# Altium project 12S ESC.PrjPcb
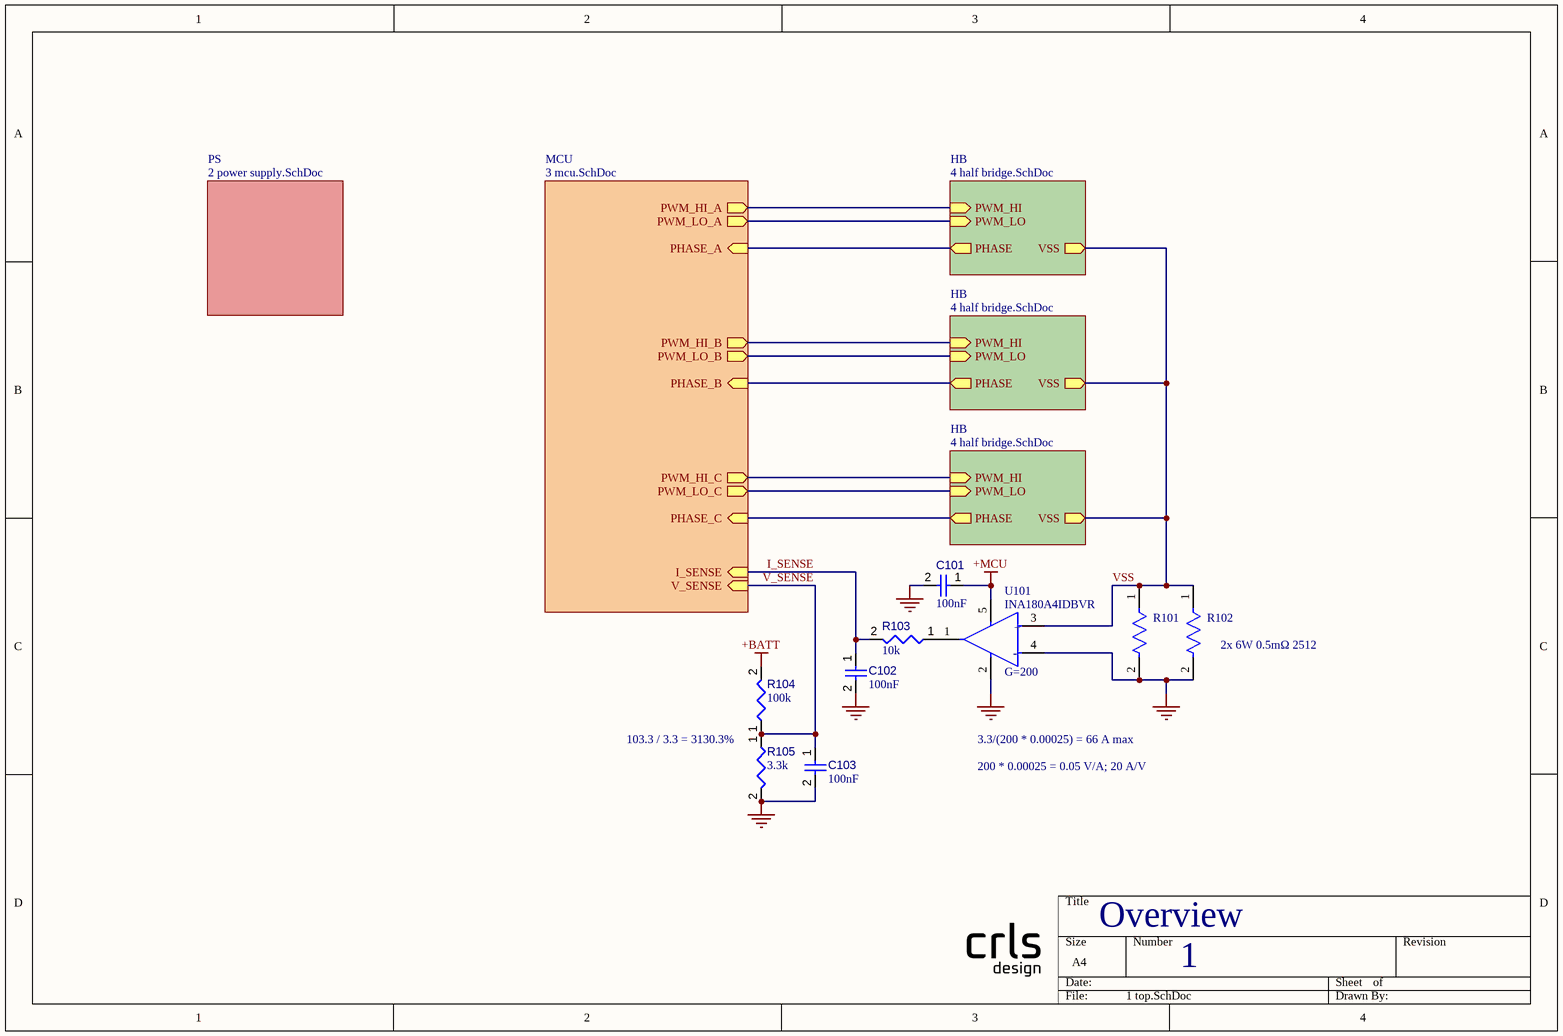
[diagram p0: 1 top.SchDoc]
4 sheets, 91 parts. Net scope: hierarchical (ports join the sheet entries above them; power ports are global).
Board files: main.PcbDoc, panel 1x1.PcbDoc, panel 2x1.PcbDoc
Sheets:
  1 top.SchDoc
    PS = 2 power supply.SchDoc
    MCU = 3 mcu.SchDoc
    HB = 4 half bridge.SchDoc
    HB = 4 half bridge.SchDoc
    HB = 4 half bridge.SchDoc

## Sheet 1 top.SchDoc
size A4; SheetNumber: 1; SheetTotal: 4

### Parts
C101  value 100nF  [CAPC0402(1005)60_L]  (hidden comment: Capacitor 100nF +/-20% 25V 0402)
C102  value 100nF  [CAPC0402(1005)60_L]  (hidden comment: Capacitor 100nF +/-20% 25V 0402)
C103  value 100nF  [CAPC0402(1005)60_L]  (hidden comment: Capacitor 100nF +/-20% 25V 0402)
R101  PSL2NTEBL500F  [FP-PSL2NTEBL500F-MFG]  (value not drawn)
R102  PSL2NTEBL500F  [FP-PSL2NTEBL500F-MFG]  (value not drawn)
R103  value 10k  [RESC0402(1005)_L]  (hidden comment: Resistor 10K  +/-1 % 0402 63 mW)
R104  value 100k  [RESC0402(1005)_L]  (hidden comment: Resistor 100K +/-1 % 0402 63 mW)
R105  value 3.3k  [RESC0402(1005)_L]  (hidden comment: Resistor 3K3 +/-1 % 0402 63 mW)
U101  INA180A4IDBVR  [FP-DBV0005A-MFG]

### Sub-sheets
HB = 4 half bridge.SchDoc: PWM_HI (in), PWM_LO (in), PHASE (out), VSS (out)
HB = 4 half bridge.SchDoc: PWM_HI (in), PWM_LO (in), PHASE (out), VSS (out)
HB = 4 half bridge.SchDoc: PWM_HI (in), PWM_LO (in), PHASE (out), VSS (out)
MCU = 3 mcu.SchDoc: PHASE_A (in), PHASE_B (in), PHASE_C (in), PWM_HI_A (out), PWM_LO_A (out), PWM_HI_B (out), PWM_LO_B (out), PWM_HI_C (out), PWM_LO_C (out), V_SENSE (in), I_SENSE (in)
PS = 2 power supply.SchDoc: no entries

### Nets
+BATT: R104.2
+MCU: C101.1 U101.5(VS)
GND: C101.2 C102.2 C103.2 R101.2 R102.2 R105.2 U101.2(GND) U101.4(IN-)
I_SENSE: C102.1 R103.2 ; sheet MCU/I_SENSE
PHASE_A: sheet MCU/PHASE_A, sheet HB/PHASE
PHASE_B: sheet MCU/PHASE_B, sheet HB/PHASE
PHASE_C: sheet MCU/PHASE_C, sheet HB/PHASE
PWM_H_A: sheet MCU/PWM_HI_A, sheet HB/PWM_HI
PWM_H_B: sheet MCU/PWM_HI_B, sheet HB/PWM_HI
PWM_H_C: sheet MCU/PWM_HI_C, sheet HB/PWM_HI
PWM_L_A: sheet MCU/PWM_LO_A, sheet HB/PWM_LO
PWM_L_B: sheet MCU/PWM_LO_B, sheet HB/PWM_LO
PWM_L_C: sheet MCU/PWM_LO_C, sheet HB/PWM_LO
V_SENSE: C103.1 R104.1 R105.1 ; sheet MCU/V_SENSE
VSS: R101.1 R102.1 U101.3(IN+) ; sheet HB/VSS, sheet HB/VSS, sheet HB/VSS
NetR103_1: R103.1 U101.1(OUT)

### Notes on the sheet
- (near R102) 2x 6W 0.5mΩ 2512
- (near U101) G=200
- (near R105) 103.3 / 3.3 = 3130.3%
- 3.3/(200 * 0.00025) = 66 A max
- 200 * 0.00025 = 0.05 V/A; 20 A/V
- Overview
- (in symbol CMP-04895-000244-1) +; -

### Library data of the parts
C101-C103 = CMP-001-00065-4: Chip Capacitor, 100nF +/-20%, 25V, 0402, Thickness 0.6 mm; Tolerance: 10%; Max Operating Temperature: 85°C; Min Operating Temperature: -55°C; Pins: 2; Voltage Rating: 25V; Mounting Technology: SMT; Case/Package: 0402
R101 R102 = CMP-04015-070281-1: RES 500 UOHM 1% 8W NONSTANDARD; RoHS Compliant: Yes
R103 = CMP-009-00149-3: Chip Resistor, 10 kOhms, +/-1 %, 63 mW, -55 to 125 degC, 0402; Power: 63mW; Tolerance: 1%; Min Operating Temperature: -55°C; Case/Package: 0402; Max Operating Temperature: 155°C; Pins: 2
R104 = CMP-009-00168-3: Chip Resistor, 100 kOhms, +/-1 %, 63 mW, -55 to 155 degC, 0402; Tolerance: 1%; Power: 63mW; Max Operating Temperature: 155°C; Min Operating Temperature: -55°C; Pins: 2; Case/Package: 0402
R105 = CMP-009-00145-3: Chip Resistor, 3.3 kOhms, +/-1 %, 63 mW, -55 to 155 degC, 0402; Tolerance: 1%; Power: 63mW; Case/Package: 0402; Min Operating Temperature: -55°C; Max Operating Temperature: 155°C; Pins: 2
U101 = CMP-04895-000244-1: IC CURR SENSE 1 CIRCUIT SOT23-5; Operating Supply Current: 260uA; Number of Circuits: 1; Input Bias Current: 100nA; -3db Bandwidth: 350kHz; Input Offset Voltage (Vos): 100uV; Slew Rate: 2V/µs; Case/Package: SOT-23-5; Min Operating Temperature: -40°C; Packaging: Tape and Reel; Max Operating Temperature: 125°C; Mount: Surface Mount; RoHS Compliant: Yes

## Sheet 2 power supply.SchDoc
size A4; SheetNumber: 2; SheetTotal: 4
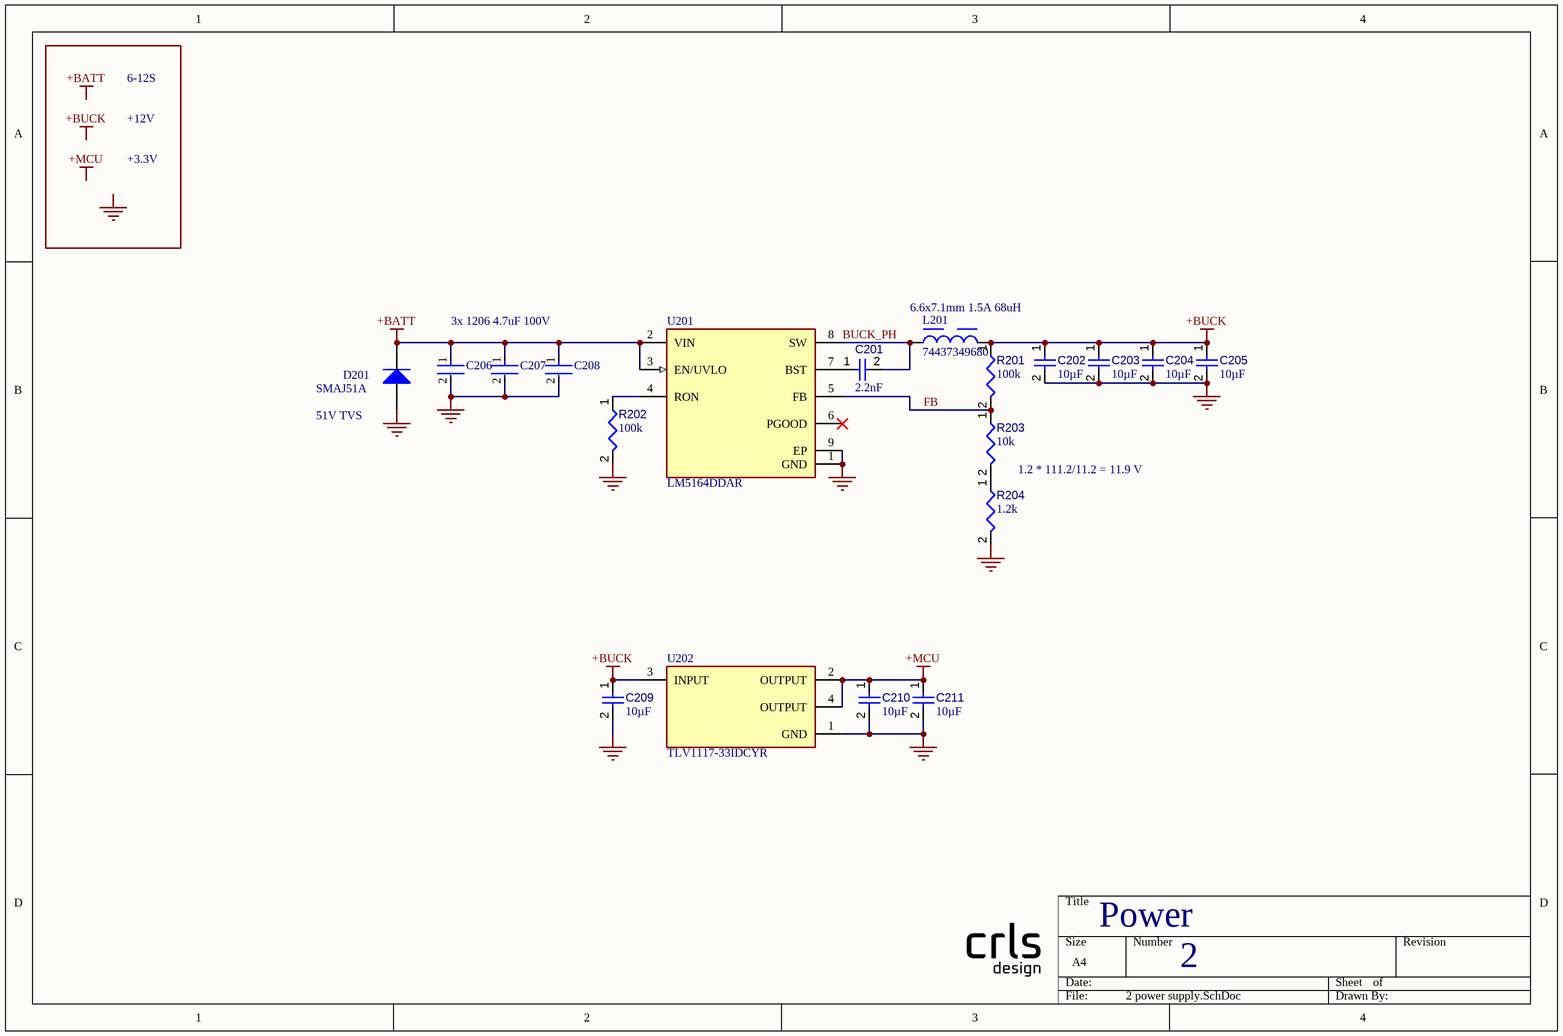
[diagram p1: 2 power supply.SchDoc]

### Parts
C201  value 2.2nF  [CAPC0402(1005)33_L]  (hidden comment: Capacitor 2.2nF +/-20% 50V 0402)
C202  value 10µF  [CAPC0603(1608)100_L]  (hidden comment: Capacitor 10µF +/-20% 10V 0603)
C203  value 10µF  [CAPC0603(1608)100_L]  (hidden comment: Capacitor 10µF +/-20% 10V 0603)
C204  value 10µF  [CAPC0603(1608)100_L]  (hidden comment: Capacitor 10µF +/-20% 10V 0603)
C205  value 10µF  [CAPC0603(1608)100_L]  (hidden comment: Capacitor 10µF +/-20% 10V 0603)
C206  12061Z475KAT2A  [FP-1206-L_3_2_0_2-W_1_6_0-MFG]  (value not drawn)
C207  12061Z475KAT2A  [FP-1206-L_3_2_0_2-W_1_6_0-MFG]  (value not drawn)
C208  12061Z475KAT2A  [FP-1206-L_3_2_0_2-W_1_6_0-MFG]  (value not drawn)
C209  value 10µF  [CAPC0603(1608)100_L]  (hidden comment: Capacitor 10µF +/-20% 10V 0603)
C210  value 10µF  [CAPC0603(1608)100_L]  (hidden comment: Capacitor 10µF +/-20% 10V 0603)
C211  value 10µF  [CAPC0603(1608)100_L]  (hidden comment: Capacitor 10µF +/-20% 10V 0603)
D201  SMAJ51A  [VISH-DO-214AC-2_N]
L201  74437349680  [WE-LHMI_7050]
R201  value 100k  [RESC0402(1005)_L]  (hidden comment: Resistor 100K +/-1 % 0402 63 mW)
R202  value 100k  [RESC0402(1005)_L]  (hidden comment: Resistor 100K +/-1 % 0402 63 mW)
R203  value 10k  [RESC0402(1005)_L]  (hidden comment: Resistor 10K  +/-1 % 0402 63 mW)
R204  value 1.2k  [RESC0402(1005)_L]  (hidden comment: Resistor 1K2 +/-1 % 0402 63 mW)
U201  LM5164DDAR  [FP-DDA0008E-MFG]
U202  TLV1117-33IDCYR  [FP-DCY0004A-MFG]

### Nets
+BATT: C206.1 C207.1 C208.1 D201.1(K) U201.2(VIN) U201.3(EN/UVLO)
+BUCK: C202.1 C203.1 C204.1 C205.1 C209.1 L201.2 R201.1 U202.3(INPUT)
+MCU: C210.1 C211.1 U202.2(OUTPUT) U202.4(OUTPUT)
GND: C202.2 C203.2 C204.2 C205.2 C206.2 C207.2 C208.2 C209.2 C210.2 C211.2 D201.2(A) R202.2 R204.2 U201.1(GND) U201.9(EP) U202.1(GND)
BUCK_PH: C201.2 L201.1 U201.8(SW)
FB: R201.2 R203.1 U201.5(FB)
NetC201_1: C201.1 U201.7(BST)
NetR202_1: R202.1 U201.4(RON)
NetR203_2: R203.2 R204.1

Not connected (* = marked no-connect by the designer): U201 6(PGOOD)*

### Notes on the sheet
- 6-12S
- +12V
- +3.3V
- 6.6x7.1mm 1.5A 68uH
- 3x 1206 4.7uF 100V
- (near D201) 51V TVS
- 1.2 * 111.2/11.2 = 11.9 V
- Power
- Labels drawn without touching a wire or pin: +BATT, +BUCK, +MCU, GND

### Library data of the parts
C201 = CMP-001-00066-3: Chip Capacitor, 1nF +/-20%, 50V, 0402, Thickness 0.33 mm; Tolerance: 10%; Case/Package: 0402; Pins: 2; Min Operating Temperature: -55°C; Max Operating Temperature: 85°C; Voltage Rating: 50V; Mounting Technology: SMT
C202-C205 C209-C211 = CMP-001-00075-4: Chip Capacitor, 10µF +/-20%, 10V, 0603, Thickness 1 mm; Tolerance: 10%; Voltage Rating: 10V; Max Operating Temperature: 85°C; Pins: 2; Case/Package: 0603; Mounting Technology: SMT; Min Operating Temperature: -55°C
C206-C208 = CMP-2000-05019-2: CAP CER 4.7UF 100V X7S 1206; Tolerance: 10%; Thickness: 0.075inch; Max Operating Temperature: 125°C; Termination: SMD/SMT; Dielectric: X7S; Case Code (Metric): 3216; Case/Package: 1206; Height: 0.5mm; Mount: Surface Mount; Voltage Rating (DC): 100V; Min Operating Temperature: -55°C; Package Quantity: 1; Length: 3.2mm; Voltage Rating: 100V; Lead Free: Lead Free; RoHS Compliant: Yes; Packaging: Tape and Reel; Weight: 0.000571oz; Capacitance: 4.7uF; REACH SVHC: No SVHC; Case Code (Imperial): 1206; Width: 0.063inch; Depth: 1.6mm
D201 = CMP-0544-00031-2: Transient Voltage Suppressor, 6.40 to 231 V, 51 V Stand-off Voltage, Uni-Directional, -55 to 155 degC, 2-pin DO-214AC, Pb-Free, Tape and Reel; Manufacturer: Vishay Semiconductor; PartNumber: SMAJ51A-E3/5A; IFSM: 40 A; ID (uA): 1; VBR Uni-Directional (V): 6.4 to 231; PPPM (W): 400, 300; VWM (V): 51; ComponentLink3Description: Package Specification; PackageDescription: 2-Pin DO-214AC (SMA), Body 4.245 x 2.665 mm; ComponentLink1Description: Manufacturer URL; ComponentLink2Description: Datasheet; ComponentLink3URL: http://www.vishay.com/docs/88390/smaj50a.pdf; DatasheetVersion: 12/8/2013; ComponentLink2URL: http://www.vishay.com/docs/88390/smaj50a.pdf; PackageReference: DO-214AC-2; RoHS: TRUE; Operating Junction and Storage Temperature Range: -55 to 150 degC; ComponentLink1URL: http://www.vishay.com/; Packing: Tape and Reel; Mounting Technology: Surface Mount
L201 = CMP-1353-00069-6: NexarPartId: 65255814; Inductance Tolerance: 20%; Saturation Current: 1.45A; Inductance: 68µH; DC Resistance (DCR): 386mΩ; Ambient Temperature Range High: 85°C; Ambient Temperature Range Low: -40°C; RoHS: Compliant; Length: 7.3mm; Min Operating Temperature: -40°C; Max Operating Temperature: 125°C; Height: 4.8mm; Width: 6.6mm
R201 R202 = CMP-009-00168-3: as R104 on sheet 1 top; Max Operating Temperature: 155°C; Min Operating Temperature: -55°C; Pins: 2; Case/Package: 0402
R203 = CMP-009-00149-3: as R103 on sheet 1 top; Min Operating Temperature: -55°C; Case/Package: 0402; Max Operating Temperature: 155°C; Pins: 2
R204 = CMP-009-00157-3: Chip Resistor, 1.2 kOhms, +/-1 %, 63 mW, -55 to 155 degC, 0402; Tolerance: 1%; Power: 63mW; Case/Package: 0402; Pins: 2; Min Operating Temperature: -55°C; Max Operating Temperature: 155°C
U201 = CMP-04918-000011-1: POWER MANAGEMENT; Manufacturer: Texas Instruments; Standoff Height: 0mm; Max Supply Voltage: 100V; Output Voltage: 1.2-90V; Max Duty Cycle: 99%; Nominal Supply Current: 600uA; Output Current: 1A; Min Supply Voltage: 6V; Output Type: AdjustableProgrammable; Max Junction Temp: +150°C; Number Of Outputs: 1; Switching Frequency: 1000kHz; Switching Topology: Buck; Temperature: -40°C to +150°C; Device Class L1: Integrated Circuits (ICs); Automotive: No; Lead Free: Yes; Package: DDA0008E; Device Class L3: Voltage Regulators - Switching; Manufacturer Part Number: LM5164DDAR; Device Class L2: Power Management ICs; RoHS: TRUE; Mouser Description: 6-V to 100-V input, 1-A synchronous buck DC-DC converter with ultra-low IQ 8-SO PowerPAD -40 to 150; Temperature Range Low: -40°C; ComponentLink2Description: Datasheet; Temperature Range High: +150°C; ComponentLink2URL: http://www.ti.com/lit/ds/symlink/lm5164.pdf; Digikey Description: POWER MANAGEMENT; Category: IC; Octopart: https://octopart.com/lm5164ddar-texas+instruments-96785744
U202 = CMP-04917-000056-1: IC REG LIN 3.3V 800MA SOT223-4; Manufacturer: Texas Instruments; Nominal Supply Current: 5mA; Dropout Voltage: 1.2V; Max Supply Voltage: 15V; Min Supply Voltage: 4.7V; Output Type: Fixed; Number Of Outputs: 1; Output Current: 0.8A; Standoff Height: 0.02mm; Max Junction Temp: +125°C; Lead Free: Yes; RoHS: TRUE; Temperature: -40°C to +125°C; Device Class L1: Integrated Circuits (ICs); Output Voltage: 3.3V; Device Class L3: Voltage Regulators - Linear; Octopart: https://octopart.com/tlv1117-33idcyr-texas+instruments-669250; Device Class L2: Power Management ICs; Package: DCY0004A; Temperature Range High: +125°C; Category: IC; Height: 1.8mm; Automotive: No; Digikey Description: IC REG LIN 3.3V 800MA SOT223-4; Temperature Range Low: -40°C; ComponentLink2URL: http://www.ti.com/lit/ds/symlink/tlv1117.pdf; ComponentLink2Description: Datasheet; Manufacturer Part Number: TLV1117-33IDCYR; Mouser Description: LDO Voltage Regulators Fixed LDO Volt Reg

## Sheet 3 mcu.SchDoc
size A4; SheetNumber: 3; SheetTotal: 4
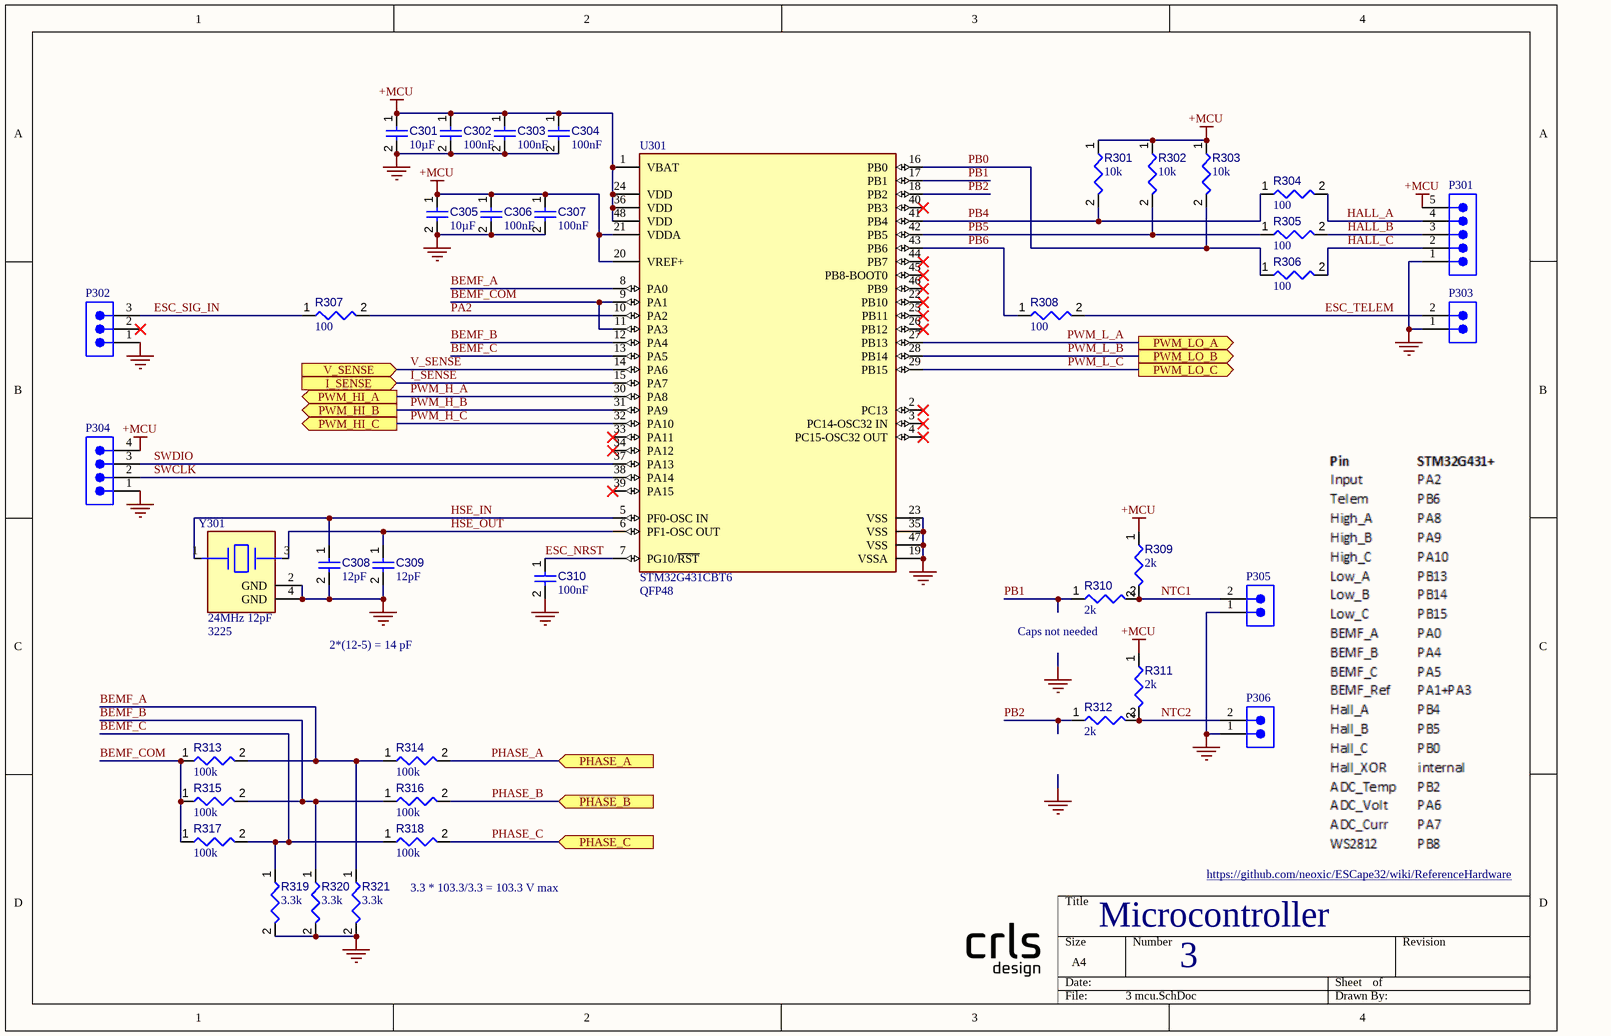
[diagram p2: 3 mcu.SchDoc]

### Parts
C301  value 10µF  [CAPC0603(1608)100_L]  (hidden comment: Capacitor 10µF +/-20% 10V 0603)
C302  value 100nF  [CAPC0402(1005)60_L]  (hidden comment: Capacitor 100nF +/-20% 25V 0402)
C303  value 100nF  [CAPC0402(1005)60_L]  (hidden comment: Capacitor 100nF +/-20% 25V 0402)
C304  value 100nF  [CAPC0402(1005)60_L]  (hidden comment: Capacitor 100nF +/-20% 25V 0402)
C305  value 10µF  [CAPC0603(1608)100_L]  (hidden comment: Capacitor 10µF +/-20% 10V 0603)
C306  value 100nF  [CAPC0402(1005)60_L]  (hidden comment: Capacitor 100nF +/-20% 25V 0402)
C307  value 100nF  [CAPC0402(1005)60_L]  (hidden comment: Capacitor 100nF +/-20% 25V 0402)
C308  value 12pF  [CAPC0402(1005)33_L]  (hidden comment: Capacitor 12pF +/-10% 50V 0402)
C309  value 12pF  [CAPC0402(1005)33_L]  (hidden comment: Capacitor 12pF +/-10% 50V 0402)
C310  value 100nF  [CAPC0402(1005)60_L]  (hidden comment: Capacitor 100nF +/-20% 25V 0402)
P301  61300511121  [61300511121]  (value not drawn)
P302  62000311121  [62000311121]  (value not drawn)
P303  62000211121  [62000211121]  (value not drawn)
P304  61300411121  [61300411121]  (value not drawn)
P305  62000211121  [62000211121]  (value not drawn)
P306  62000211121  [62000211121]  (value not drawn)
R301  value 10k  [RESC0402(1005)_L]  (hidden comment: Resistor 10K  +/-1 % 0402 63 mW)
R302  value 10k  [RESC0402(1005)_L]  (hidden comment: Resistor 10K  +/-1 % 0402 63 mW)
R303  value 10k  [RESC0402(1005)_L]  (hidden comment: Resistor 10K  +/-1 % 0402 63 mW)
R304  value 100  [RESC0402(1005)_L]  (hidden comment: Resistor 100R +/-1 % 0402 63 mW)
R305  value 100  [RESC0402(1005)_L]  (hidden comment: Resistor 100R +/-1 % 0402 63 mW)
R306  value 100  [RESC0402(1005)_L]  (hidden comment: Resistor 100R +/-1 % 0402 63 mW)
R307  value 100  [RESC0402(1005)_L]  (hidden comment: Resistor 100R +/-1 % 0402 63 mW)
R308  value 100  [RESC0402(1005)_L]  (hidden comment: Resistor 100R +/-1 % 0402 63 mW)
R309  value 2k  [RESC0402(1005)_L]  (hidden comment: Resistor 2K +/-5 % 0402 63 mW)
R310  value 2k  [RESC0402(1005)_L]  (hidden comment: Resistor 2K +/-5 % 0402 63 mW)
R311  value 2k  [RESC0402(1005)_L]  (hidden comment: Resistor 2K +/-5 % 0402 63 mW)
R312  value 2k  [RESC0402(1005)_L]  (hidden comment: Resistor 2K +/-5 % 0402 63 mW)
R313  value 100k  [RESC0402(1005)_L]  (hidden comment: Resistor 100K +/-1 % 0402 63 mW)
R314  value 100k  [RESC0402(1005)_L]  (hidden comment: Resistor 100K +/-1 % 0402 63 mW)
R315  value 100k  [RESC0402(1005)_L]  (hidden comment: Resistor 100K +/-1 % 0402 63 mW)
R316  value 100k  [RESC0402(1005)_L]  (hidden comment: Resistor 100K +/-1 % 0402 63 mW)
R317  value 100k  [RESC0402(1005)_L]  (hidden comment: Resistor 100K +/-1 % 0402 63 mW)
R318  value 100k  [RESC0402(1005)_L]  (hidden comment: Resistor 100K +/-1 % 0402 63 mW)
R319  value 3.3k  [RESC0402(1005)_L]  (hidden comment: Resistor 3K3 +/-1 % 0402 63 mW)
R320  value 3.3k  [RESC0402(1005)_L]  (hidden comment: Resistor 3K3 +/-1 % 0402 63 mW)
R321  value 3.3k  [RESC0402(1005)_L]  (hidden comment: Resistor 3K3 +/-1 % 0402 63 mW)
U301  STM32G431CBT6  [FP-LQFP48-5B-MFG]
Y301  TSX-3225 24.0000MF20G-AC3  [FP-TSX-3225-MFG]  (value not drawn)

### Ports
I_SENSE (in), PHASE_A (in), PHASE_B (in), PHASE_C (in), PWM_HI_A (out), PWM_HI_B (out), PWM_HI_C (out), PWM_LO_A (out), PWM_LO_B (out), PWM_LO_C (out), V_SENSE (in)

### Nets
+MCU: C301.1 C302.1 C303.1 C304.1 C305.1 C306.1 C307.1 P301.5 P304.4 R301.1 R302.1 R303.1 R309.1 R311.1 U301.1(VBAT) U301.20(VREF+) U301.21(VDDA) U301.24(VDD) U301.36(VDD) U301.48(VDD)
GND: C301.2 C302.2 C303.2 C304.2 C305.2 C306.2 C307.2 C308.2 C309.2 C310.2 P301.1 P302.1 P303.1 P304.1 P305.1 P306.1 R319.2 R320.2 R321.2 U301.19(VSSA) U301.23(VSS) U301.35(VSS) U301.47(VSS) Y301.2(GND) Y301.4(GND)
BEMF_A: R313.2 R314.1 R321.1 U301.8(PA0)
BEMF_B: R315.2 R316.1 R320.1 U301.12(PA4)
BEMF_C: R317.2 R318.1 R319.1 U301.13(PA5)
BEMF_COM: R313.1 R315.1 R317.1 U301.9(PA1) U301.11(PA3)
ESC_NRST: C310.1 U301.7(PG10/~{RST})
ESC_SIG_IN: P302.3 R307.1
ESC_TELEM: P303.2 R308.2
HALL_A: P301.4 R304.2
HALL_B: P301.3 R305.2
HALL_C: P301.2 R306.2
HSE_IN: C308.1 U301.5(PF0-OSC_IN) Y301.1
HSE_OUT: C309.1 U301.6(PF1-OSC_OUT) Y301.3
I_SENSE: U301.15(PA7) ; port I_SENSE
NTC1: P305.2 R309.2 R310.2
NTC2: P306.2 R311.2 R312.2
PA2: R307.2 U301.10(PA2)
PB0: R303.2 R306.1 U301.16(PB0)
PB1: R310.1 U301.17(PB1)
PB2: R312.1 U301.18(PB2)
PB4: R301.2 R304.1 U301.41(PB4)
PB5: R302.2 R305.1 U301.42(PB5)
PB6: R308.1 U301.43(PB6)
PHASE_A: R314.2 ; port PHASE_A
PHASE_B: R316.2 ; port PHASE_B
PHASE_C: R318.2 ; port PHASE_C
PWM_H_A: U301.30(PA8) ; port PWM_HI_A
PWM_H_B: U301.31(PA9) ; port PWM_HI_B
PWM_H_C: U301.32(PA10) ; port PWM_HI_C
PWM_L_A: U301.27(PB13) ; port PWM_LO_A
PWM_L_B: U301.28(PB14) ; port PWM_LO_B
PWM_L_C: U301.29(PB15) ; port PWM_LO_C
SWCLK: P304.2 U301.38(PA14)
SWDIO: P304.3 U301.37(PA13)
V_SENSE: U301.14(PA6) ; port V_SENSE

Not connected (* = marked no-connect by the designer): P302 2*; U301 2(PC13)* 3(PC14-OSC32_IN)* 4(PC15-OSC32_OUT)* 22(PB10)* 25(PB11)* 26(PB12)* 33(PA11)* 34(PA12)* 39(PA15)* 40(PB3)* 44(PB7)* 45(PB8-BOOT0)* 46(PB9)*

### Notes on the sheet
- (near Y301) 24MHz 12pF
- (near Y301) 3225
- 2*(12-5) = 14 pF
- (near U301) QFP48
- Caps not needed
- 3.3 * 103.3/3.3 = 103.3 V max
- https://github.com/neoxic/ESCape32/wiki/ReferenceHardware
- Microcontroller

### Library data of the parts
C301 C305 = CMP-001-00075-4: as C202 on sheet 2 power supply; Voltage Rating: 10V; Max Operating Temperature: 85°C; Pins: 2; Case/Package: 0603; Mounting Technology: SMT; Min Operating Temperature: -55°C
C302-C304 C306 C307 C310 = CMP-001-00065-4: as C101 on sheet 1 top; Max Operating Temperature: 85°C; Min Operating Temperature: -55°C; Pins: 2; Voltage Rating: 25V; Mounting Technology: SMT; Case/Package: 0402
C308 C309 = CMP-001-00072-4: Chip Capacitor, 12pF +/-10%, 50V, 0402, Thickness 0.33 mm; Tolerance: 20%; Pins: 2; Max Operating Temperature: 85°C; Case/Package: 0402; Voltage Rating: 50V; Mounting Technology: SMT; Min Operating Temperature: -55°C
P301 = CMP-1502-01068-3: NexarPartId: 32855526; Connector Type: Male Pin; Gender: Male; Contact Resistance: 20mΩ; Pitch: 2.54mm; Operating Supply Voltage: 250V; Current Rating: 3A; Number of Contacts: 5; Lead Free: Lead Free; Color: Black; Packaging: Bulk; Lead Pitch: 2.54mm; Contact Material: Copper; Min Operating Temperature: -40°C; Contact Mating Length: 5.9944mm; Voltage Rating: 250V; Number of Pins: 5; Number of Positions: 5; Height: 8.89mm; Orientation: Vertical; REACH SVHC: Unknown; RoHS: Compliant; Contact Plating: Gold; Max Operating Temperature: 105°C; Mount: Through Hole; Number of Rows: 1; Termination: Solder
P302 = CMP-1502-00957-4: NexarPartId: 61924779; Contact Resistance: 20mΩ; Voltage Rating: 200V; Current Rating: 2A; Number of Contacts: 3; Gender: Male; Max Operating Temperature: 105°C; Min Operating Temperature: -40°C; Number of Pins: 3; RoHS: Non-Compliant; Contact Material: Gold; Height: 6.35mm; Operating Supply Voltage: 200V; Number of Rows: 1; Lead Pitch: 2mm; Orientation: Vertical
P303 P305 P306 = CMP-1502-00956-4: NexarPartId: 61924778; Current Rating: 2A; Operating Supply Voltage: 200V; Contact Resistance: 20mΩ; Number of Contacts: 2; Gender: Male; RoHS: Non-Compliant; Max Operating Temperature: 105°C; Voltage Rating: 200V; Contact Material: Gold; Height: 6.35mm; Number of Rows: 1; Lead Pitch: 2mm; Min Operating Temperature: -40°C; Number of Pins: 2; Orientation: Vertical
P304 = CMP-1502-01064-3: NexarPartId: 32855522; Operating Supply Voltage: 250V; Pitch: 2.54mm; Contact Resistance: 20mΩ; Number of Positions: 4; Current Rating: 3A; Connector Type: Male Pin; Gender: Male; Contact Plating: Gold; Height: 8.89mm; Lead Pitch: 2.54mm; Lead Free: Lead Free; Contact Mating Length: 5.9944mm; Number of Rows: 1; Termination: Solder; Packaging: Bulk; REACH SVHC: Unknown; Min Operating Temperature: -40°C; RoHS: Compliant; Number of Contacts: 4; Voltage Rating: 250V; Color: Black; Max Operating Temperature: 105°C; Contact Material: Copper; Mount: Through Hole; Orientation: Vertical; Number of Pins: 4
R301-R303 = CMP-009-00149-3: as R103 on sheet 1 top; Min Operating Temperature: -55°C; Case/Package: 0402; Max Operating Temperature: 155°C; Pins: 2
R304-R308 = CMP-009-00167-3: Chip Resistor, 100 Ohms, +/-1 %, 63 mW, -55 to 155 degC, 0402; Power: 63mW; Tolerance: 1%; Min Operating Temperature: -55°C; Case/Package: 0402; Pins: 2; Max Operating Temperature: 155°C
R309-R312 = CMP-009-00138-3: Chip Resistor, 2 kOhms, +/-5 %, 63 mW, -55 to 155 degC, 0402; Tolerance: 5%; Power: 63mW; Max Operating Temperature: 155°C; Pins: 2; Min Operating Temperature: -55°C; Case/Package: 0402
R313-R318 = CMP-009-00168-3: as R104 on sheet 1 top; Max Operating Temperature: 155°C; Min Operating Temperature: -55°C; Pins: 2; Case/Package: 0402
R319-R321 = CMP-009-00145-3: as R105 on sheet 1 top; Case/Package: 0402; Min Operating Temperature: -55°C; Max Operating Temperature: 155°C; Pins: 2
U301 = CMP-12105-000030-1: MAINSTREAM ARM CORTEX-M4+ MCU 17; Manufacturer: STMicroelectronics; Number Of Adc Channels: 17; Number Of I/Os: 38; Standoff Height: 0.05mm; Number Of Usb Channels: 1; Data Bus Width: 32bits; Number Of I2C Channels: 3; Number Of Pwm Channels: 31; Frequency: 170MHz; Memory Type: FLASH; Number Of Timers/Counters: 14; Ram Size: 32KBytes; Max Junction Temp: +105°C; Memory Size: 128KBytes; Min Supply Voltage: 1.62V; Max Supply Voltage: 3.6V; Number Of Uart Channels: 4; Interface: I2C,SPI,UART,USART,CAN,USB,LIN,IrDA,I2S; Temperature Range Low: -40°C; Lead Free: Yes; Device Class L3: Microcontrollers; Number Of Cores: 1; Temperature Range High: +85°C; Height: 1.6mm; Digikey Description: MAINSTREAM ARM CORTEX-M4+ MCU 17; Device Class L1: Integrated Circuits (ICs); Package: LQFP48-5B; RoHS: TRUE; Number Of A/D Converters: 1; Core Architecture: Arm Cortex-M4; Device Class L2: Embedded Processors and Controllers; ComponentLink2Description: Datasheet; Temperature: -40°C to +85°C; Ambient Temperature Range High: +85°C; Ambient Temperature Range Low: -40°C; Octopart: https://octopart.com/stm32g431cbt6-stmicroelectronics-98835224; ComponentLink2URL: https://www.st.com/resource/en/datasheet/stm32g431cb.pdf; Automotive: No; Number Of Spi Channels: 3; Manufacturer Part Number: STM32G431CBT6; Category: IC
Y301 = CMP-36405-000018-1: CRYSTAL 24.0000MHZ 9PF SMD; ESR (Equivalent Series Resistance): 40R; Frequency Stability: 20ppm; Frequency: 24MHz; Tolerance: 10ppm; Drive Level: 200uW; Min Operating Temperature: -40°C; RoHS Compliant: Yes; Width: 2.5mm; Max Operating Temperature: 105°C; Package Quantity: 250; Load Capacitance: 9pF; Mount: Surface Mount; Lead Free: Lead Free; Height: 0.024inch; Depth: 2.5mm; Packaging: Tape and Reel; Series: TSX-3225; Weight: 0.000564oz; Number of Pins: 4; Termination: SMD/SMT; Case/Package: SMD/SMT; Length: 3.2mm; Frequency Tolerance: 10ppm

## Sheet 4 half bridge.SchDoc
size A4; SheetNumber: 4; SheetTotal: 4
Used 3 times, as channels HB, HB, HB. Parts and nets are listed once, with the designators drawn on the sheet.
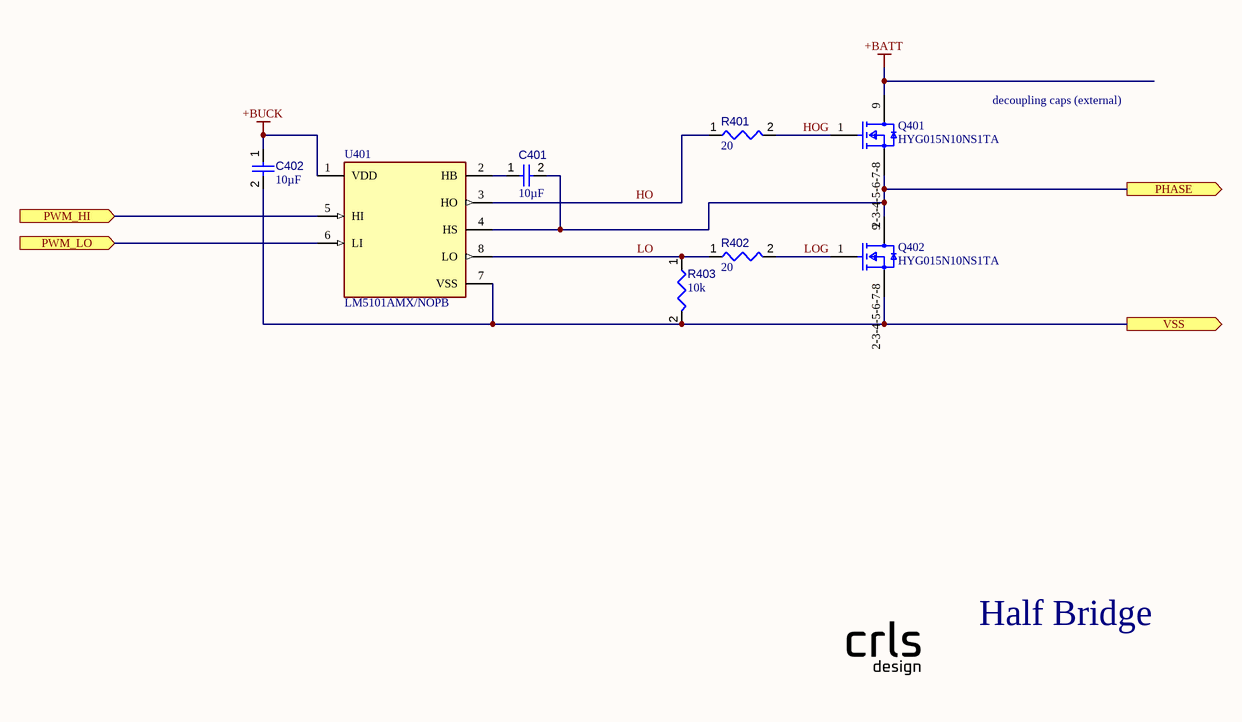
[diagram p3: 4 half bridge.SchDoc]

### Parts
C401  value 10µF  [CAPC0603(1608)100_L]  (hidden comment: Capacitor 10µF +/-20% 10V 0603)
C402  value 10µF  [CAPC0603(1608)100_L]  (hidden comment: Capacitor 10µF +/-20% 10V 0603)
Q401  HYG015N10NS1TA  [FP-PG-HSOF-8-MFG]
Q402  HYG015N10NS1TA  [FP-PG-HSOF-8-MFG]
R401  value 20  [RESC0603(1608)_L]  (hidden comment: Resistor 20R +/-5 % 0603 0.1 W)
R402  value 20  [RESC0603(1608)_L]  (hidden comment: Resistor 20R +/-5 % 0603 0.1 W)
R403  value 10k  [RESC0402(1005)_L]  (hidden comment: Resistor 10K  +/-1 % 0402 63 mW)
U401  LM5101AMX/NOPB  [FP-D0008A-MFG]

### Ports
PHASE (out), PWM_HI (in), PWM_LO (in), VSS (out)

### Nets
+BATT: Q401.9(D)
+BUCK: C402.1 U401.1(VDD)
HO: R401.1 U401.3(HO)
HOG: Q401.1(G) R401.2
LO: R402.1 R403.1 U401.8(LO)
LOG: Q402.1(G) R402.2
PHASE: C401.2 Q401.2-3-4-5-6-7-8(S) Q402.9(D) U401.4(HS) ; port PHASE
PWM_HI: U401.5(HI) ; port PWM_HI
PWM_LO: U401.6(LI) ; port PWM_LO
VSS: C402.2 Q402.2-3-4-5-6-7-8(S) R403.2 U401.7(VSS) ; port VSS
NetC401_1: C401.1 U401.2(HB)

### Channels
HB: designators end in _HB3; ports PHASE=PHASE_A PWM_HI=PWM_H_A PWM_LO=PWM_L_A VSS=VSS
HB: designators end in _HB2; ports PHASE=PHASE_B PWM_HI=PWM_H_B PWM_LO=PWM_L_B VSS=VSS
HB: designators end in _HB1; ports PHASE=PHASE_C PWM_HI=PWM_H_C PWM_LO=PWM_L_C VSS=VSS

### Notes on the sheet
- decoupling caps (external)
- Half Bridge

### Library data of the parts
C401 C402 = CMP-001-00075-4: as C202 on sheet 2 power supply; Voltage Rating: 10V; Max Operating Temperature: 85°C; Pins: 2; Case/Package: 0603; Mounting Technology: SMT; Min Operating Temperature: -55°C
Q401 Q402 = CMP-00196-91542042-1: HYG015N10NS1TA 100V, N-Ch, 1.2 mΩ max, Automotive MOSFET, TOLL, OptiMOS™-5, PG-HSOF-8, RoHS; Max Junction Temperature (Tj): 175°C; Continuous Drain Current (ID): 200A; Turn-Off Delay Time: 30ns; Turn-On Delay Time: 16ns; Drain to Source Voltage (Vdss): 80V; Drain to Source Resistance: 1.8mΩ; Gate to Source Voltage (Vgs): 20V; Power Dissipation: 200W; Number of Channels: 1; NexarPartId: 91542042; Lifecycle Status: Production; Max Operating Temperature: 175°C; Min Operating Temperature: -55°C; Drain to Source Breakdown Voltage: 80V; Manufacturer Package Identifier: PG-HSOF-8; Packaging: Tape & Reel; Package Quantity: 2000; Schedule B: 8541290080, 8541290080; RoHS: Non-Compliant
R401 R402 = CMP-009-00183-1: Chip Resistor, 20 Ohms, +/-5 %, 0.1 W, -55 to 155 degC, 0603; Tolerance: 5%; Power: 100mW; Pins: 2; Max Operating Temperature: 155°C; Case/Package: 0603; Min Operating Temperature: -55°C
R403 = CMP-009-00149-3: as R103 on sheet 1 top; Min Operating Temperature: -55°C; Case/Package: 0402; Max Operating Temperature: 155°C; Pins: 2
U401 = CMP-04912-000094-1: IC GATE DRVR HALF-BRIDGE 8SOIC; Supply Current: 2mA; Number of Channels: 2; Turn-Off Delay Time: 4ns; Min Supply Voltage: 9V; Max Supply Voltage: 14V; Rise Time: 430ns; Propagation Delay: 26ns; Max Output Current: 3A; Quiescent Current: 200uA; Fall Time: 260ns; Series: LM5101A; Number of Outputs: 2; Mount: Surface Mount; RoHS Compliant: Yes; Nominal Supply Current: 2mA; Case/Package: SOIC; Number of Pins: 8; Number of Drivers: 2; Lead Free: Lead Free; Max Operating Temperature: 125°C; Output Current: 3A; Package Quantity: 2500; Radiation Hardening: No; Min Operating Temperature: -40°C; Packaging: Tape and Reel; Turn-On Delay Time: 4ns

## Nets that join several sheets
+BATT: 1 top (R104.2), 2 power supply (6 pins), HB (Q401_HB3.9), HB (Q401_HB2.9), HB (Q401_HB1.9)
+BUCK: 2 power supply (8 pins), HB (C402_HB3.1 U401_HB3.1), HB (C402_HB2.1 U401_HB2.1), HB (C402_HB1.1 U401_HB1.1)
+MCU: 1 top (C101.1 U101.5), 2 power supply (C210.1 C211.1 U202.2 U202.4), 3 mcu (20 pins)
GND: 1 top (8 pins), 2 power supply (16 pins), 3 mcu (25 pins)
I_SENSE: 1 top (C102.1 R103.2), 3 mcu (U301.15)
PHASE_A: 3 mcu (R314.2), HB (C401_HB3.2 Q401_HB3.2-3-4-5-6-7-8 Q402_HB3.9 U401_HB3.4)
PHASE_B: 3 mcu (R316.2), HB (C401_HB2.2 Q401_HB2.2-3-4-5-6-7-8 Q402_HB2.9 U401_HB2.4)
PHASE_C: 3 mcu (R318.2), HB (C401_HB1.2 Q401_HB1.2-3-4-5-6-7-8 Q402_HB1.9 U401_HB1.4)
PWM_H_A: 3 mcu (U301.30), HB (U401_HB3.5)
PWM_H_B: 3 mcu (U301.31), HB (U401_HB2.5)
PWM_H_C: 3 mcu (U301.32), HB (U401_HB1.5)
PWM_L_A: 3 mcu (U301.27), HB (U401_HB3.6)
PWM_L_B: 3 mcu (U301.28), HB (U401_HB2.6)
PWM_L_C: 3 mcu (U301.29), HB (U401_HB1.6)
V_SENSE: 1 top (C103.1 R104.1 R105.1), 3 mcu (U301.14)
VSS: 1 top (R101.1 R102.1 U101.3), HB (C402_HB3.2 Q402_HB3.2-3-4-5-6-7-8 R403_HB3.2 U401_HB3.7), HB (C402_HB2.2 Q402_HB2.2-3-4-5-6-7-8 R403_HB2.2 U401_HB2.7), HB (C402_HB1.2 Q402_HB1.2-3-4-5-6-7-8 R403_HB1.2 U401_HB1.7)